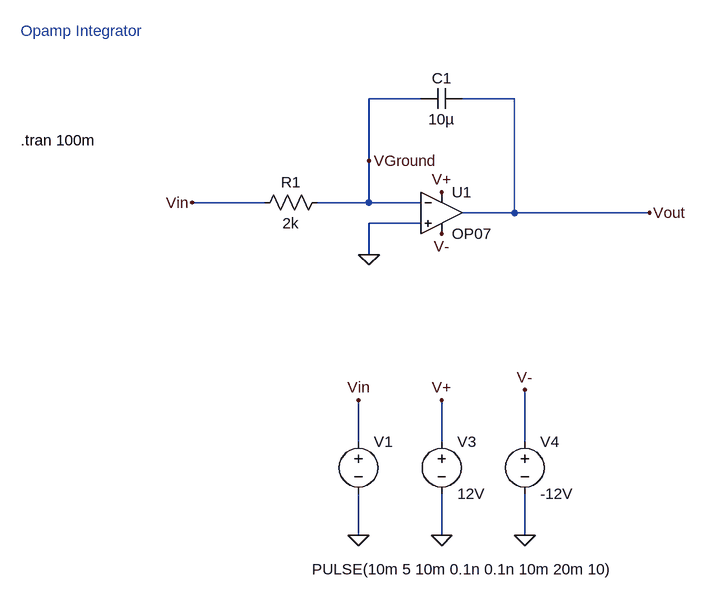
[diagram p0: schematic opamp_integrator.asc]
opamp_integrator.asc, the LTspice schematic file:
Version 4
SHEET 1 880 680
WIRE 128 -336 48 -336
WIRE 272 -336 192 -336
WIRE 48 -240 48 -336
WIRE -112 -176 -224 -176
WIRE 48 -176 48 -240
WIRE 48 -176 -32 -176
WIRE 128 -176 48 -176
WIRE 272 -160 272 -336
WIRE 272 -160 192 -160
WIRE 480 -160 272 -160
WIRE 128 -144 48 -144
WIRE 160 -128 160 -144
WIRE 48 -96 48 -144
WIRE 32 192 32 128
WIRE 160 192 160 128
WIRE 288 192 288 112
WIRE 32 336 32 272
WIRE 160 336 160 272
WIRE 288 336 288 272
FLAG 32 336 0
FLAG 160 336 0
FLAG 288 336 0
FLAG 160 128 V+
FLAG 288 112 V-
FLAG 160 -192 V+
FLAG 32 128 Vin
FLAG 480 -160 Vout
FLAG -224 -176 Vin
FLAG 48 -96 0
FLAG 48 -240 VGround
FLAG 160 -128 V-
SYMBOL voltage 32 176 R0
WINDOW 123 0 0 Left 0
WINDOW 39 0 0 Left 0
WINDOW 3 -72 212 Left 2
SYMATTR InstName V1
SYMATTR Value PULSE(10m 5 10m 0.1n 0.1n 10m 20m 10)
SYMBOL OpAmps\\OP07 160 -224 R0
SYMATTR InstName U1
SYMBOL voltage 160 176 R0
WINDOW 123 0 0 Left 0
WINDOW 39 0 0 Left 0
SYMATTR InstName V3
SYMATTR Value 12V
SYMBOL voltage 288 176 R0
WINDOW 123 0 0 Left 0
WINDOW 39 0 0 Left 0
SYMATTR InstName V4
SYMATTR Value -12V
SYMBOL res -16 -192 R90
WINDOW 0 0 56 VBottom 2
WINDOW 3 32 56 VTop 2
SYMATTR InstName R1
SYMATTR Value 2k
SYMBOL cap 192 -352 R90
WINDOW 0 0 32 VBottom 2
WINDOW 3 32 32 VTop 2
SYMATTR InstName C1
SYMATTR Value 10µ
TEXT -488 -272 Left 2 !.tran 100m
TEXT -488 -440 Left 2 ;Opamp Integrator

The netlist it stands for:
* opamp_integrator.asc
V1 Vin 0 PULSE(10m 5 10m 0.1n 0.1n 10m 20m 10)
XU1 0 VGround V+ V- Vout LT1001  ; OP07, pins In+ In- V+ V- OUT
V3 V+ 0 12V
V4 V- 0 -12V
R1 VGround Vin 2k
C1 Vout VGround 10µ
.tran 100m
* Opamp Integrator
.lib LTC.lib
.backanno
.end